# EAGLE design SFT_BatteryManager1.0v (EAGLE 7.5.0)
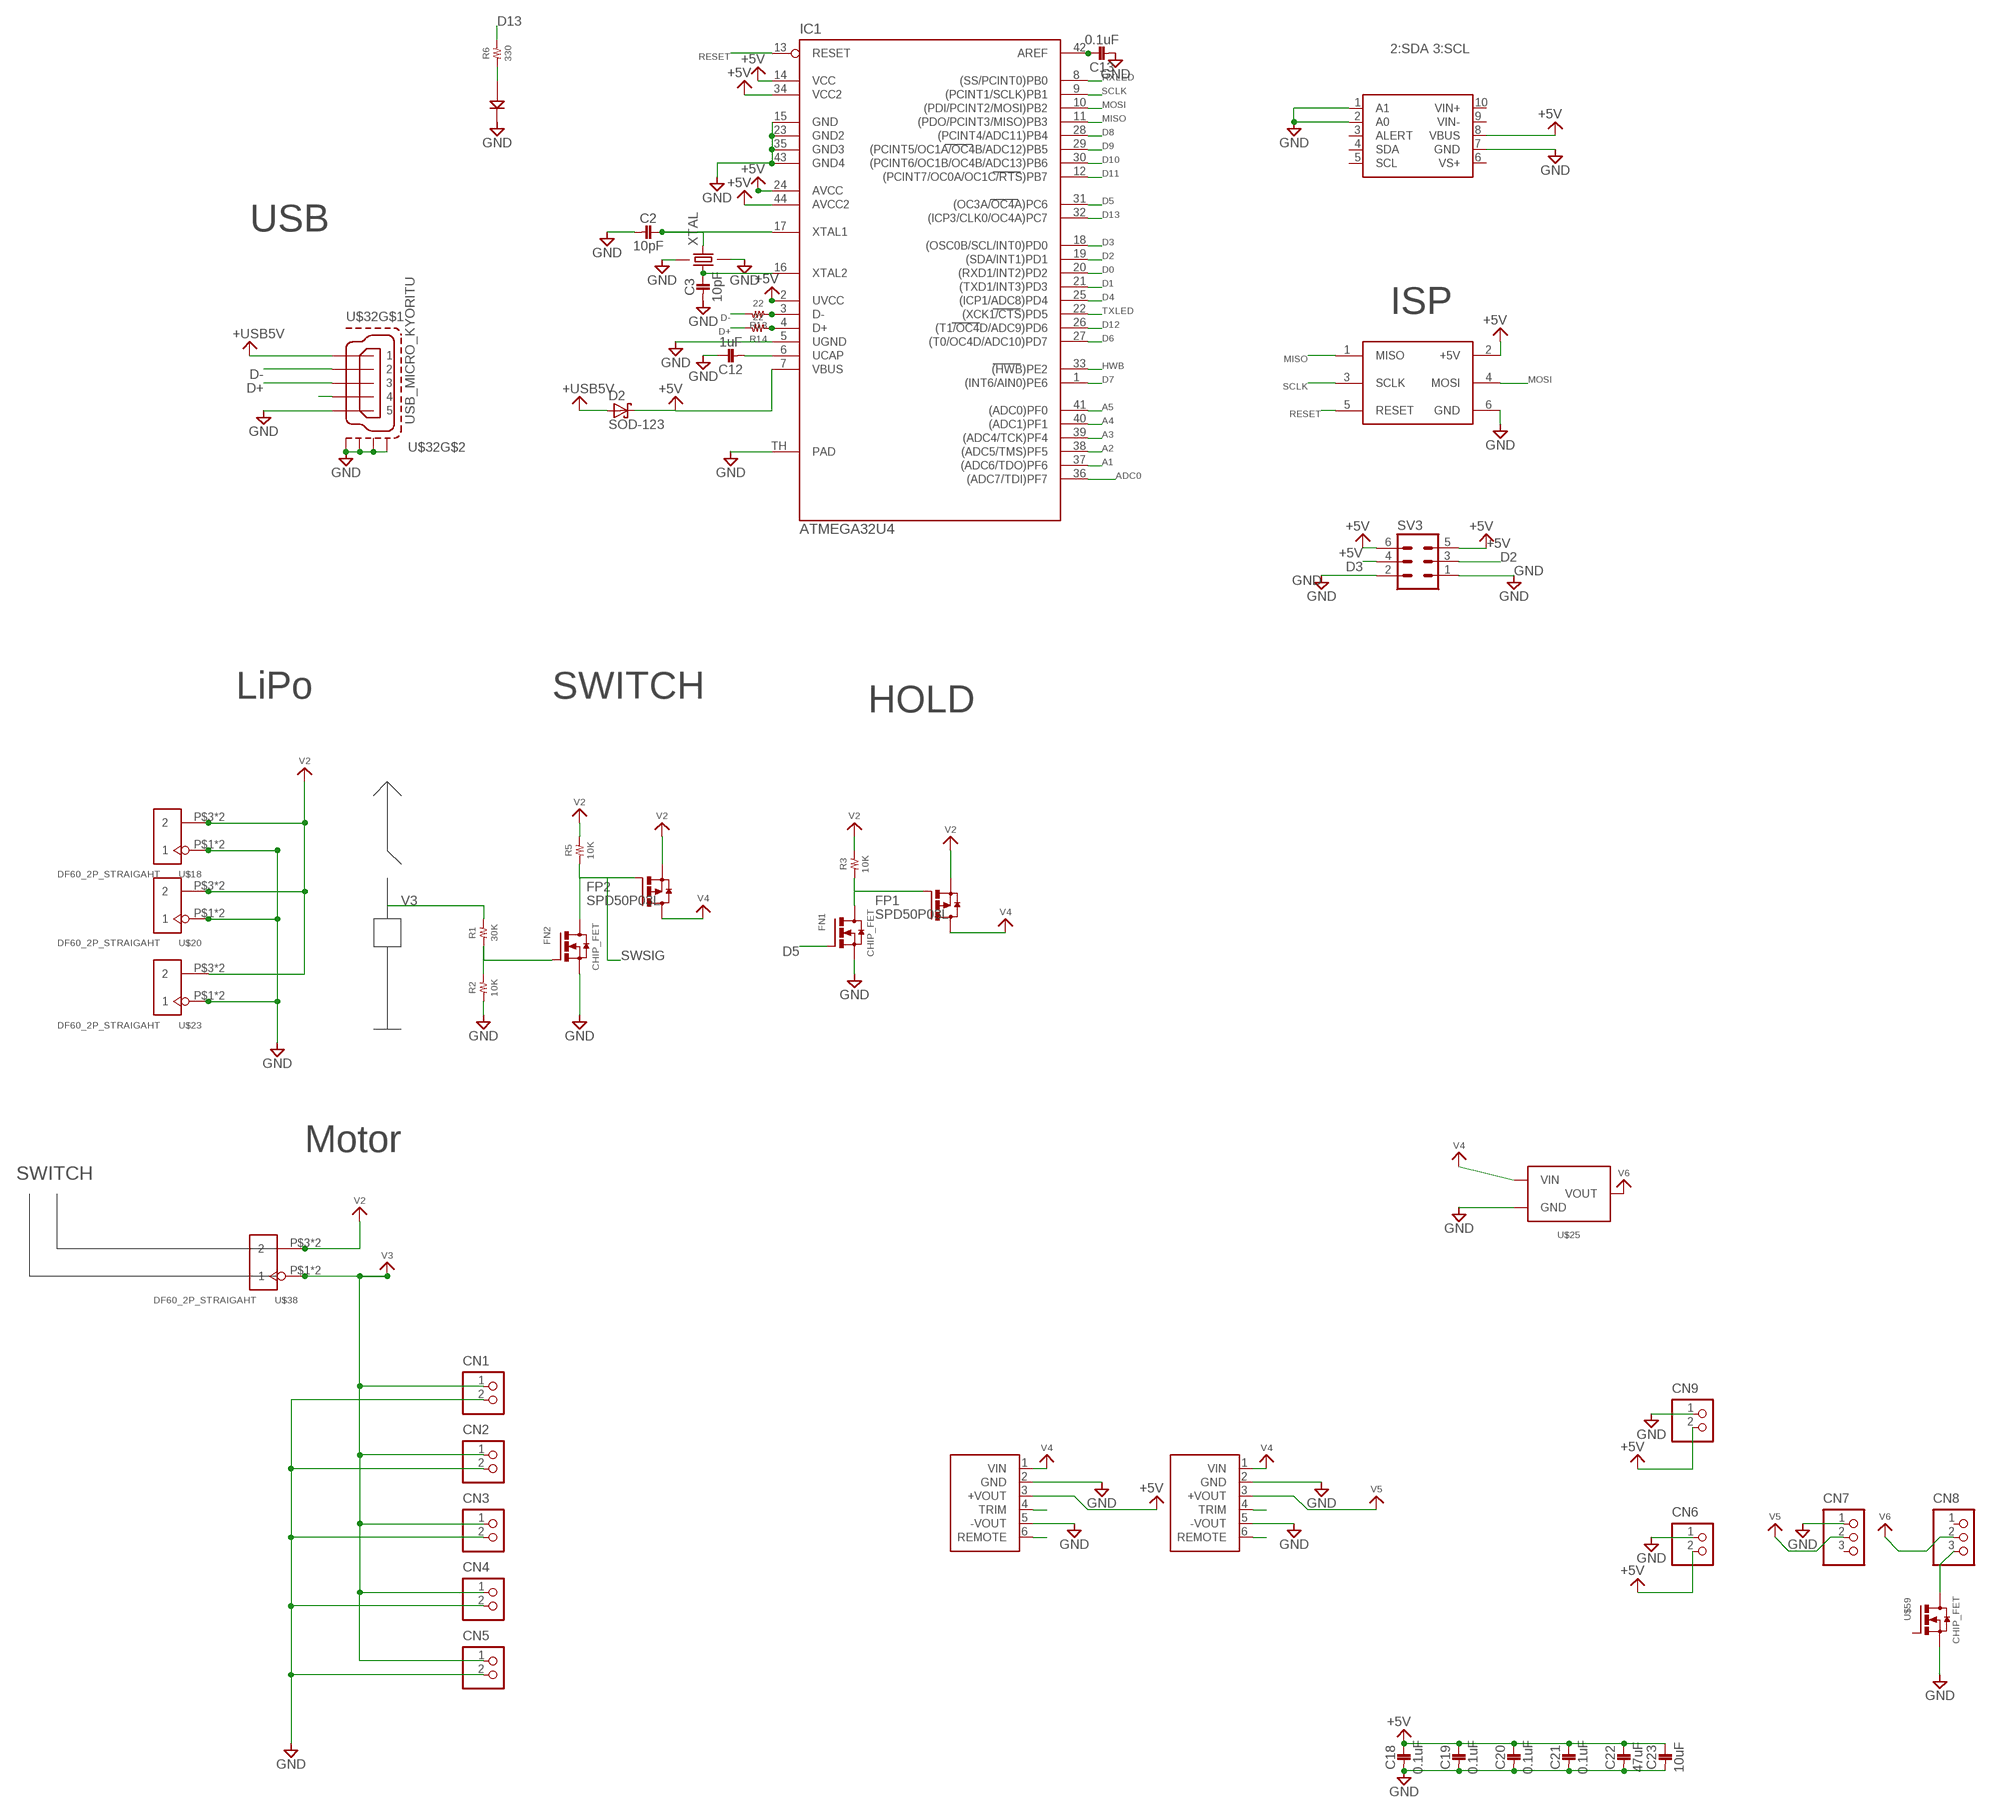
[diagram p0: schematic, sheet 1]

## Parts
C2  10pF  1005  [1005]
C3  10pF  1005  [1005]
C12  1uF  1005  [1005]
C13  0.1uF  1005  [1005]
C18  0.1uF  1005  [1005]
C19  0.1uF  1005  [1005]
C20  0.1uF  1005  [1005]
C21  0.1uF  1005  [1005]
C22  47uF  1608  [1608]
C23  10uF  1608  [1608]
CN1  B2P-VH  [B2P-VH]
CN2  B2P-VH  [B2P-VH]
CN3  B2P-VH  [B2P-VH]
CN4  B2P-VH  [B2P-VH]
CN5  B2P-VH  [B2P-VH]
CN6  B2B-XASK-1  [B2B-XASK-1]
CN7  B3P-VH  [B3P-VH]
CN8  B3P-VH  [B3P-VH]
CN9  B2B-XASK-1  [B2B-XASK-1]
D2  SOD-123  [SOD_123]
FN1  CHIP_FET  [SOT23]
FN2  CHIP_FET  [SOT23]
FP1  SPD50P03L  [TO252-5-11]
FP2  SPD50P03L  [TO252-5-11]
IC1  ATMEGA32U4  [QFN-44-7X7]
LED1  3MMLED  [3MM]
R1  30K  RESISTOR_1005  [1005]
R2  10K  RESISTOR_1005  [1005]
R3  10K  RESISTOR_1005  [1005]
R5  10K  RESISTOR_1005  [1005]
R6  330  RESISTOR_1005  [1005]
R13  22  RESISTOR_1005  [1005]
R14  22  RESISTOR_1005  [1005]
SV3  ML6  [ML6]
U$3  ICSP  [ICSP]
U$4  INA226  [MSOP10]
U$18  DF60_2P_STRAIGAHT  [DF60_2P_STRAIGHT]
U$20  DF60_2P_STRAIGAHT  [DF60_2P_STRAIGHT]
U$23  DF60_2P_STRAIGAHT  [DF60_2P_STRAIGHT]
U$25  Ｒ－７８Ｅ５．０  [Ｒ－７８Ｅ５．０]
U$29  TRACO_THL  [TRACO_THL]
U$32  USB_MICRO_KYORITU  [USB_MICRO_KYORITU]
U$38  DF60_2P_STRAIGAHT  [DF60_2P_STRAIGHT]
U$59  CHIP_FET  [SOT23]
U$62  TRACO_THL  [TRACO_THL]
XTAL  FA-238  [FA-238]

## Nets
+5V: C18.1 C19.1 C20.1 C21.1 C22.P$1 C23.P$1 CN6.2 CN9.2 D2.C IC1.2(UVCC) IC1.7(VBUS) IC1.14(VCC) IC1.24(AVCC) IC1.34(VCC2) IC1.44(AVCC2) SV3.5 SV3.6 U$3.2(+5V) U$4.8(VBUS) U$29.3(+VOUT)
+USB5V: D2.A U$32.1
A1: IC1.37((ADC6/TDO)PF6)
A2: IC1.38((ADC5/TMS)PF5)
A3: IC1.39((ADC4/TCK)PF4)
A4: IC1.40((ADC1)PF1)
A5: IC1.41((ADC0)PF0)
ADC0: IC1.36((ADC7/TDI)PF7)
D0: IC1.20((RXD1/INT2)PD2)
D1: IC1.21((TXD1/INT3)PD3)
D2: IC1.19((SDA/INT1)PD1) SV3.3
D3: IC1.18((OSC0B/SCL/INT0)PD0) SV3.4
D4: IC1.25((ICP1/ADC8)PD4)
D5: FN1.1(G) IC1.31((OC3A/OC4A)PC6)
D6: IC1.27((T0/OC4D/ADC10)PD7)
D7: IC1.1((INT6/AIN0)PE6)
D8: IC1.28((PCINT4/ADC11)PB4)
D9: IC1.29((PCINT5/OC1A/OC4B/ADC12)PB5)
D10: IC1.30((PCINT6/OC1B/OC4B/ADC13)PB6)
D11: IC1.12((PCINT7/OC0A/OC1C/RTS)PB7)
D12: IC1.26((T1/OC4D/ADC9)PD6)
D13: IC1.32((ICP3/CLK0/OC4A)PC7) R6.2
D+: R14.2 U$32.3
D-: R13.2 U$32.2
GND: C2.2 C3.2 C12.1 C13.2 C18.2 C19.2 C20.2 C21.2 C22.P$2 C23.P$2 CN1.2 CN2.2 CN3.2 CN4.2 CN5.2 CN6.1 CN7.1 CN9.1 FN1.2(S) FN2.2(S) IC1.5(UGND) IC1.15(GND) IC1.23(GND2) IC1.35(GND3) IC1.43(GND4) IC1.TH(PAD) LED1.K R2.1 SV3.1 SV3.2 U$3.6(GND) U$4.1(A1) U$4.2(A0) U$4.7(GND) U$18.P$1 U$18.P$2 U$20.P$1 U$20.P$2 U$23.P$1 U$23.P$2 U$25.2(GND) U$29.2(GND) U$29.5(-VOUT) U$32.5 U$32.M1(S1) U$32.M2(S2) U$32.M3(S3) U$32.M4(S4) U$59.2(S) U$62.2(GND) U$62.5(-VOUT) XTAL.2 XTAL.4
HWB: IC1.33((HWB)PE2)
MISO: IC1.11((PDO/PCINT3/MISO)PB3) U$3.1(MISO)
MOSI: IC1.10((PDI/PCINT2/MOSI)PB2) U$3.4(MOSI)
N$1: LED1.A R6.1
N$2: FN2.1(G) R1.1 R2.2
N$3: U$29.4(TRIM)
N$4: U$32.4
N$5: U$29.6(REMOTE)
N$6: FN1.3(D) FP1.1(G) FP1.2(G) R3.1
N$7: C3.1 IC1.16(XTAL2) XTAL.1
N$8: IC1.3(D-) R13.1
N$9: C13.1 IC1.42(AREF)
N$10: C2.1 IC1.17(XTAL1) XTAL.3
N$11: U$62.4(TRIM)
N$12: U$62.6(REMOTE)
N$13: CN8.3 U$59.3(D)
N$14: IC1.4(D+) R14.1
N$18: C12.2 IC1.6(UCAP)
RESET: IC1.13(RESET) U$3.5(RESET)
RXLED: IC1.8((SS/PCINT0)PB0)
SCLK: IC1.9((PCINT1/SCLK)PB1) U$3.3(SCLK)
SWSIG: FN2.3(D) FP2.1(G) FP2.2(G) R5.1
TXLED: IC1.22((XCK1/CTS)PD5)
V2: FP1.4(S) FP1.5(S) FP2.4(S) FP2.5(S) R3.2 R5.2 U$18.P$3 U$18.P$4 U$20.P$3 U$20.P$4 U$23.P$3 U$23.P$4 U$38.P$3 U$38.P$4
V3: CN1.1 CN2.1 CN3.1 CN4.1 CN5.1 R1.2 U$38.P$1 U$38.P$2
V4: FP1.TAB(D) FP2.TAB(D) U$25.1(VIN) U$29.1(VIN) U$62.1(VIN)
V5: CN7.2 U$62.3(+VOUT)
V6: CN8.2 U$25.3(VOUT)
Unconnected: CN7.3 CN8.1 U$4.3(ALERT) U$4.4(SDA) U$4.5(SCL) U$4.6(VS+) U$4.9(VIN-) U$4.10(VIN+) U$59.1(G)

## Notes on the sheet
- 2:SDA 3:SCL
- USB
- ISP
- LiPo | SWITCH
- HOLD
- Motor
- SWITCH

## Library data of the parts
C2 C3 C12 C13 C18-C21 = 02_C:1005
C22 C23 = 02_C:1608
CN1-CN5 = jst-vh:B2P-VH: Wire-to-Board 3.96mm pitch top mount connector Source: http://www.jst-mfg.com/product/pdf/jpn/VH.pdf http://www.jst-mfg.com/product/detail.php?series=262
CN6 CN9 = jst-xa:B2B-XASK-1: Wire-to-Board 2.5mm pitch top mount connector Source: http://www.jst-mfg.com/product/pdf/jpn/XA1.pdf http://www.jst-mfg.com/product/detail.php?series=272
CN7 CN8 = jst-vh:B3P-VH: Wire-to-Board 3.96mm pitch top mount connector Source: http://www.jst-mfg.com/product/pdf/jpn/VH.pdf http://www.jst-mfg.com/product/detail.php?series=262
D2 = 15_DIODE:SOD-123
FN1 FN2 U$59 = 06_FET:CHIP_FET
FP1 FP2 = 06_FET:SPD50P03L
IC1 = 04_IC:ATMEGA32U4
LED1 = 10_LED:3MMLED
R1-R3 R5 R6 R13 R14 = 01_R:RESISTOR_1005
SV3 = con-ml:ML6: HARTING; OC_FARNELL: unknown; OC_NEWARK: unknown
U$3 = 08_CONECTOR:ICSP
U$4 = 04_IC:INA226
U$18 U$20 U$23 U$38 = 08_CONECTOR:DF60_2P_STRAIGAHT
U$25 = 04_IC:Ｒ－７８Ｅ５．０
U$29 U$62 = 04_IC:TRACO_THL
U$32 = 08_CONECTOR:USB_MICRO_KYORITU
XTAL = 09_2_CRYSTAL:FA-238

## Net classes
1 POWER: width 0.5 mm, clearance 0.5 mm

## Board
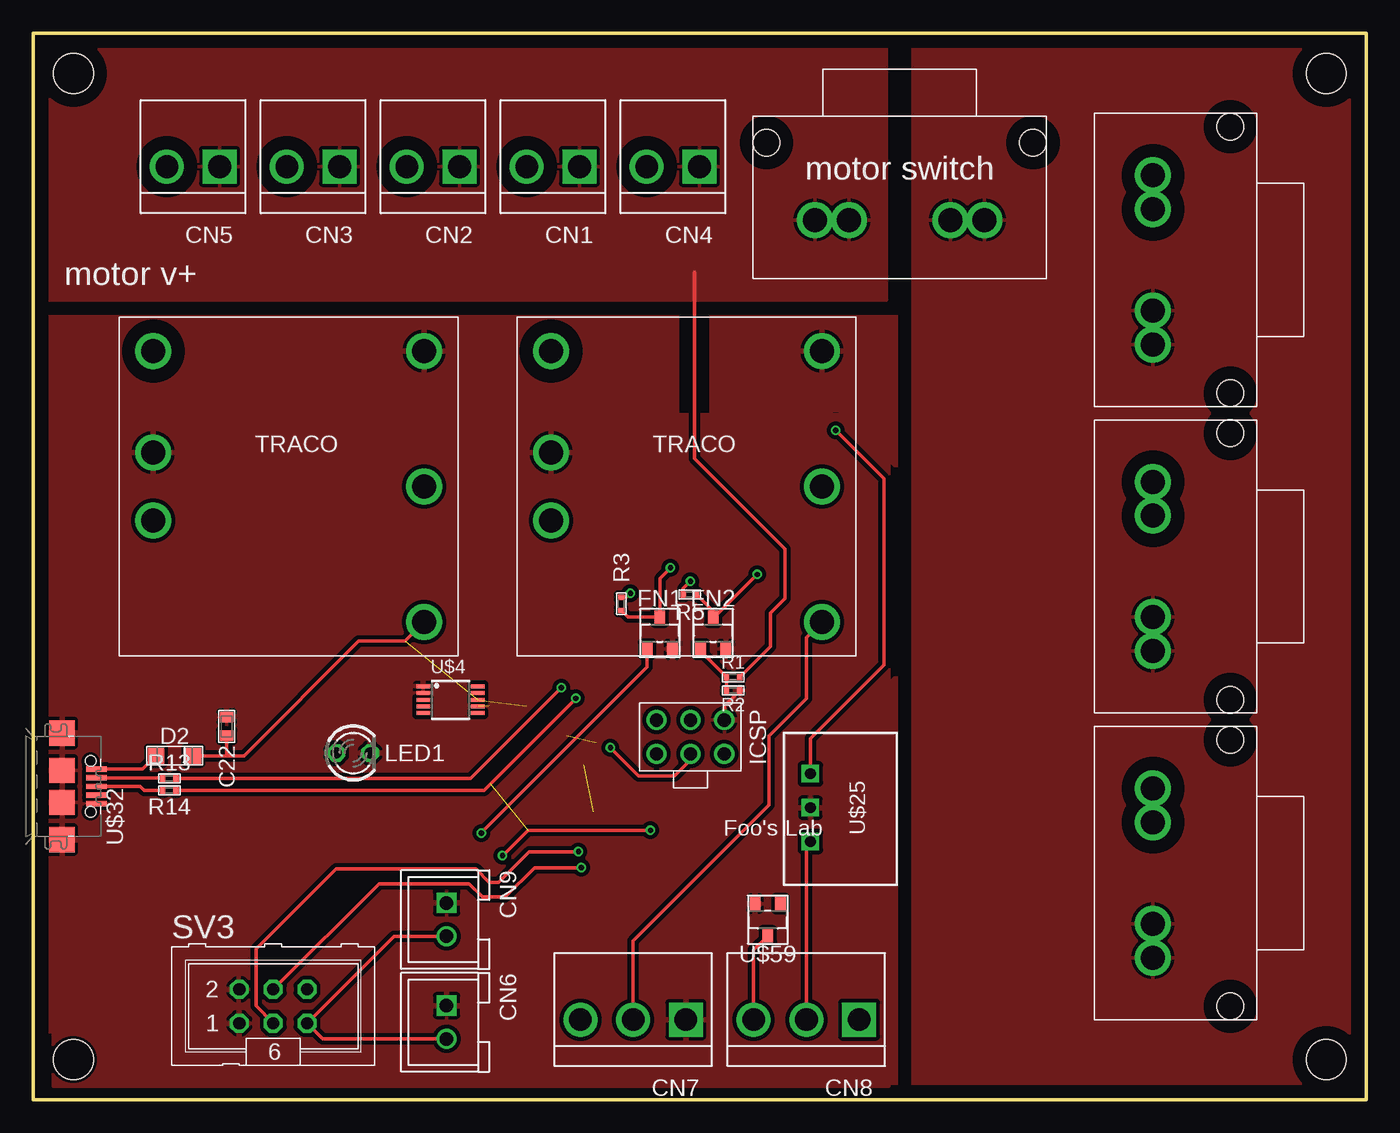
[diagram p1: board, top side]
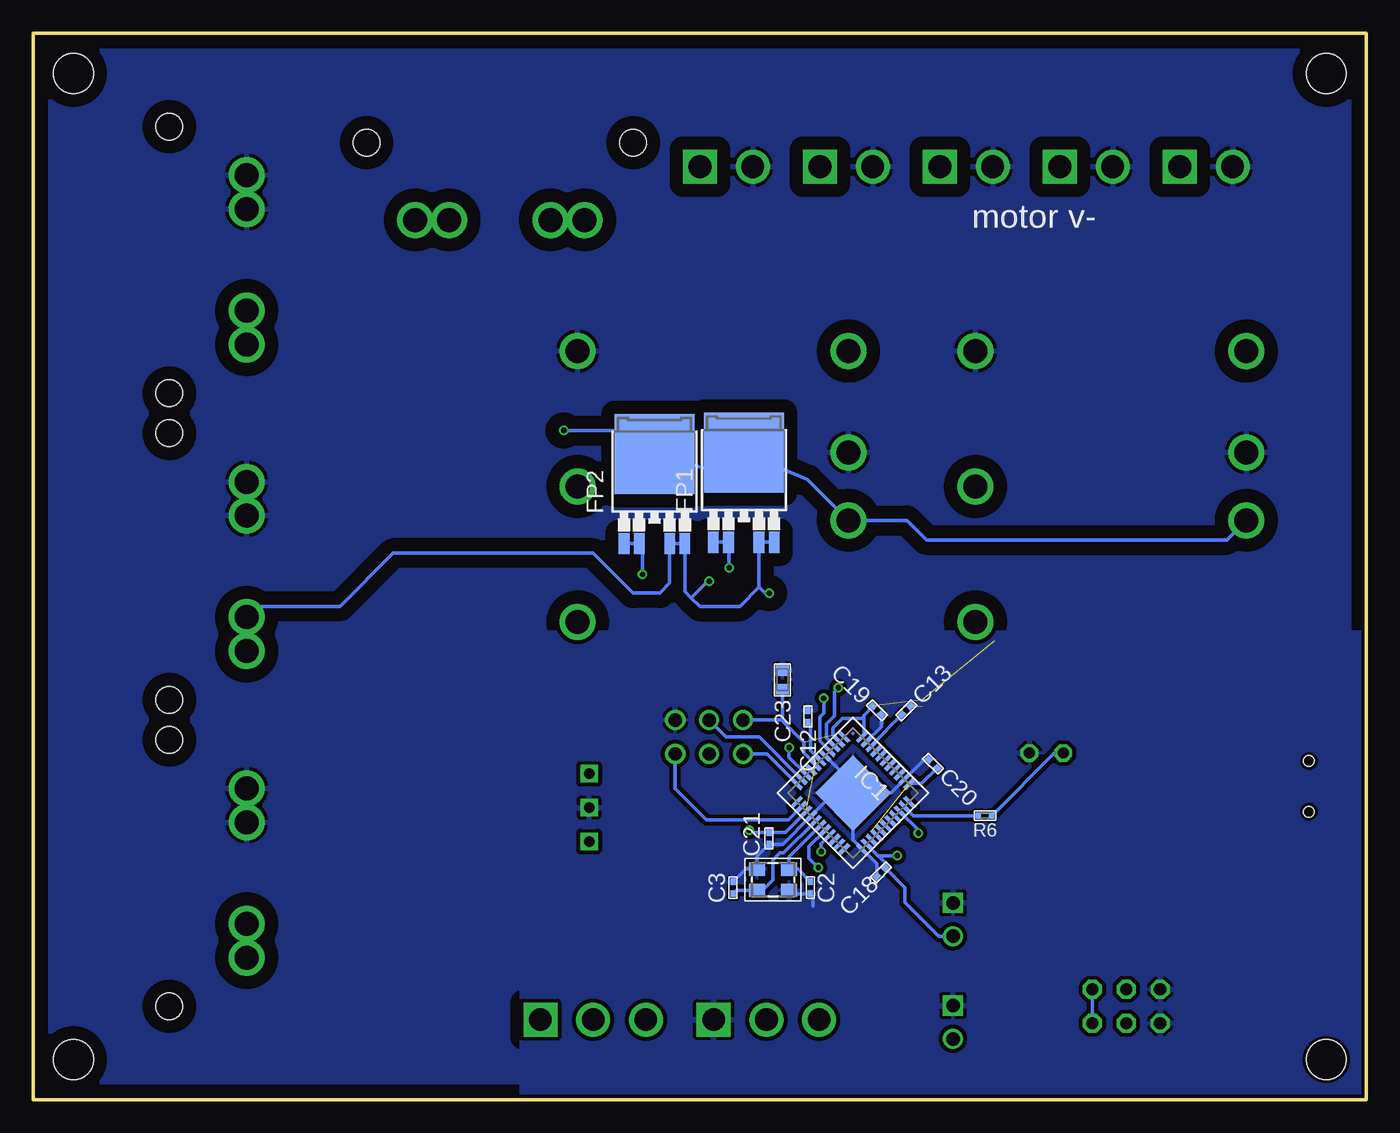
[diagram p2: board, bottom side, seen from below]

Size 100 x 80 mm. Coordinates in mm from the lower left corner, seen from the top.
Outline: 0,0 100,0 100,80 0,80 0,0
Copper layers (1*16): Top 0.035mm / dielectric 1.5mm / Bottom 0.035mm
Design rules "LPKF": minimum track width 6mil, minimum drill 12mil, track to track 0.3mm, track to pad 0.3mm, pad to pad 0.3mm, via to via 0.3mm, smd to smd 0mil, copper to edge 10mil, drill to drill 0.4mm, minimum pad ring 10mil, minimum via ring 6mil, stop-mask expansion 2mil, vias tented up to drill 100mil, thermal gap 10mil
Holes 3 mm at 97,77 97,3 3,3 3,77

### Footprints (pad centres in the part's own frame; a part is rotated, then mirrored left to right if it is on the bottom)
1005 = smd 0.5 x 0.4: 1 -0.45,0; 2 0.45,0
1608 = smd 0.8 x 1: P$1 -0.7,0; P$2 0.7,0
B2P-VH = drill 1.7 square: 1 -1.98,0 | drill 1.7: 2 1.98,0
B2B-XASK-1 = drill 1.016 square: 1 -1.25,0 | drill 1.016: 2 1.25,0
B3P-VH = drill 1.7 square: 1 -3.96,0 | drill 1.7: 2 0,0; 3 3.96,0
SOD_123 = smd 1.2 x 1.2: A -1.4,0; C 1.4,0
SOT23 = smd 0.8 x 1: 1 -0.95,-1.2; 2 0.95,-1.2; 3 0,1.2
TO252-5-11 = smd 0.8 x 1.6: 1 -2.28,-4.775; 2 -1.14,-4.775; 4 1.14,-4.775; 5 2.28,-4.775 | smd 6 x 6: TAB 0,1.935
QFN-44-7X7 = smd 1.1 x 0.3: 1 -3.5,2.5; 2 -3.5,2; 3 -3.5,1.5; 4 -3.5,1; 5 -3.5,0.5; 6 -3.5,0; 7 -3.5,-0.5; 8 -3.5,-1; 9 -3.5,-1.5; 10 -3.5,-2; 11 -3.5,-2.5; 23 3.5,-2.5; 24 3.5,-2; 25 3.5,-1.5; 26 3.5,-1; 27 3.5,-0.5; 28 3.5,0; 29 3.5,0.5; 30 3.5,1; 31 3.5,1.5; 32 3.5,2; 33 3.5,2.5 | smd 0.3 x 1.1: 12 -2.5,-3.5; 13 -2,-3.5; 14 -1.5,-3.5; 15 -1,-3.5; 16 -0.5,-3.5; 17 0,-3.5; 18 0.5,-3.5; 19 1,-3.5; 20 1.5,-3.5; 21 2,-3.5; 22 2.5,-3.5; 34 2.5,3.5; 35 2,3.5; 36 1.5,3.5; 37 1,3.5; 38 0.5,3.5; 39 0,3.5; 40 -0.5,3.5; 41 -1,3.5; 42 -1.5,3.5; 43 -2,3.5; 44 -2.5,3.5 | smd 4 x 4: TH 0,0
3MM = drill 0.813 octagon: A 0,1.27; K 0,-1.27
1005' = smd 0.4 x 0.5: 1 -0.5,0; 2 0.5,0
ML6 = drill 0.914 octagon: 1 -2.54,-1.27; 2 -2.54,1.27; 3 0,-1.27; 4 0,1.27; 5 2.54,-1.27; 6 2.54,1.27
ICSP = drill 1 pad 1.5: 1 -1.27,2.54; 2 1.27,2.54; 3 -1.27,0; 4 1.27,0; 5 -1.27,-2.54; 6 1.27,-2.54
MSOP10 = smd 0.3 x 1: 1 -1,-2.05; 2 -0.5,-2.05; 3 0,-2.05; 4 0.5,-2.05; 5 1,-2.05; 6 1,2.05; 7 0.5,2.05; 8 0,2.05; 9 -0.5,2.05; 10 -1,2.05
DF60_2P_STRAIGHT = drill 1.8: P$1 -6.35,0; P$2 -3.81,0; P$3 3.81,0; P$4 6.35,0 | hole 2: -10,5.8; 10,5.8
Ｒ－７８Ｅ５．０ = drill 0.8 square: 1 -2.54,0; 2 0,0; 3 2.54,0
TRACO_THL = drill 1.8: 1 -10.16,-2.54; 2 -10.16,2.54; 3 10.16,-10.16; 4 10.16,0; 5 10.16,10.16; 6 -10.16,10.16
USB_MICRO_KYORITU = smd 0.4 x 1.55: 1 -1.3,-0.775; 2 -0.65,-0.775; 3 0,-0.775; 4 0.65,-0.775; 5 1.3,-0.775 | smd 1.9 x 1.9: M1 4,-3.35; M2 -4,-3.35; M3 -1.2,-3.35; M4 1.2,-3.35 | hole 0.8: -1.9,-1.2; 1.9,-1.2
FA-238 = smd 1.2 x 1: 1 -1.2,-0.8; 2 1.2,-0.8; 3 1.2,0.8; 4 -1.2,0.8

### Placement (x,y rotation side)
C2  41.7,15.9 270 bottom
C3  47.5,15.9 90 bottom
C12  41.9,28.75 270 bottom
C13  34.5,29.2 45 bottom
C18  36.4,17.05 225 bottom
C19  36.7,29.2 315 bottom
C20  32.5,25.2 135 bottom
C21  44.8,19.6 270 bottom
C22  14.5,28 90 top
C23  43.8,31.5 90 bottom
CN1  39,70 180 top
CN2  30,70 180 top
CN3  21,70 180 top
CN4  48,70 180 top
CN5  12,70 180 top
CN6  31,5.8 270 top
CN7  45,6 180 top
CN8  58,6 180 top
CN9  31,13.5 270 top
D2  10.6,25.8 0 top
FN1  47,35 0 top
FN2  51,35 0 top
FP1  46.7,46.6 0 bottom
FP2  53.4,46.5 0 bottom
IC1  38.5,23 315 bottom
LED1  24,26 90 top
R1  30K  [1005']  52.5,31.7 0 top
R2  10K  [1005']  52.5,30.7 180 top
R3  10K  [1005']  44.1,37.2 90 top
R5  10K  [1005']  49.25,37.9 180 top
R6  330  [1005']  28.6,21.3 180 bottom
R13  22  [1005']  10.2,24.1 180 top
R14  22  [1005']  10.2,23.2 180 top
SV3  18,7 0 top
U$3  49.3,27.2 90 top
U$4  31.3,30 270 top
U$18  84,63 270 top
U$20  84,40 270 top
U$23  84,17 270 top
U$25  58.3,21.9 270 top
U$29  19.16,46 0 top
U$32  5.5,23.5 270 top
U$38  65,66 0 top
U$59  55.1,13.5 180 top
U$62  49,46 0 top
XTAL  44.5,16.5 0 bottom

### Tracks (layer width: path | path; a pad name or v marks a point on that pad's centre or on a via)
+5V  (via drill 0.4)  (5 unrouted)
  Top 0.25: D2.C 14.4,25.8 | 14.4,25.8 15.8,25.8 24.4,34.4 27.88,34.4 U$29.3 | C22.P$1 14.5,25.9 14.4,25.8 | v35.2,18.3 37.1,20.2 v46.3,20.2 | CN6.2 21.72,4.55 SV3.5 27.06,12.25 CN9.2
  Bottom 0.25: IC1.14 43.57,20.05 C21.1 46.15,20.05 v46.3,20.2 | 43.87,28.47 U$3.2 | IC1.7 42.2,25.99 42.2,26.8 43.87,28.47 | IC1.34 33.36,23.71 C20.1 | IC1.44 37.7,27.34 37.7,28.6 | 37.7,28.6 37.7,28.84 C19.1 | C23.P$1 43.8,28.54 43.87,28.47 | IC1.2 40,27.33 40,27.9 39.3,28.6 37.7,28.6 | SV3.6 SV3.5 | v35.2,18.3 36.63,18.3 IC1.24 36.08,17.75 C18.1 34.6,15.89 34.6,14.8 32.05,12.25 CN9.2
+USB5V
  Top 0.25: U$32.1 8.2,24.8 D2.A
D2  (via drill 0.4)
  Top 0.25: SV3.3 16.7,7.03 16.7,11.3 22.7,17.3 33.2,17.3 34.2,16.3 34.9,16.3 37.2,18.6 v40.9,18.6
  Bottom 0.25: v40.9,18.6 40.9,19.19 IC1.19
D3  (via drill 0.4)
  Top 0.25: v41.1,17.4 37.6,17.4 35.4,15.2 33.7,15.2 32.7,16.2 25.93,16.2 SV3.4
  Bottom 0.25: v41.1,17.4 41.8,18.1 41.8,18.99 IC1.18
D5  (via drill 0.4)
  Top 0.25: v33.6,20 46.05,32.45 FN1.1
  Bottom 0.25: IC1.31 33.6,20.22 v33.6,20
D13
  Bottom 0.25: IC1.32 33.97,21.3 R6.2
D+
  Top 0.25: U$32.3 8,23.5 8.3,23.2 R14.2
D-
  Top 0.25: U$32.2 9.65,24.15 R13.2
GND  (1 unrouted)
  Top 0.25: R2.1 51.84,29.54 U$3.6
  Bottom 0.25: C3.2 46.55,17.3 XTAL.4 45.7,18.25 C21.2 43.76,19.15 IC1.15 39.91,23 IC1.TH | XTAL.2 43.05,15.45 C2.2 41.5,15.25 41.5,14.5 | IC1.5 38.5,23.71 IC1.TH | IC1.TH 38.5,19.46 IC1.23 36.72,17.68 C18.2 | IC1.TH 35.67,23 IC1.35 33.15,25.52 C20.2 | IC1.43 36.38,27.95 C19.2
  pour Bottom (isolate 1, rank 6): -10,90 110,90 110,-5 -10,-5
  pour Top (isolate 1, rank 6): -10,85 115,85 115,-5 -10,-5
  pour Top: 1.5,51.4 64.2,51.4 64.2,1 1.5,1
  pour Bottom: 0.4,0.3 63.4,0.3 63.4,35.1 0.4,35.1
MISO
  Bottom 0.25: IC1.11 44.97,25.93 U$3.1
MOSI
  Bottom 0.25: IC1.10 45.53,27.2 48.03,27.2 U$3.4
N$1
  Bottom 0.25: R6.1 23.4,26 LED1.A
N$2
  Top 0.25: FN2.1 50.05,33.65 R1.1 R2.2
N$6  (via drill 0.4)
  Top 0.25: v47.8,39.9 47,39.1 FN1.3 44.6,36.2 R3.1
  Bottom 0.25: FP1.1 FP1.2 47.8,41.78 v47.8,39.9
N$7
  Bottom 0.25: IC1.16 43.71,18.5 44,18.5 44.5,18 44.5,16.5 45.3,15.7 XTAL.1 47.25,15.7 C3.1
N$8  (via drill 0.4)
  Top 0.25: v39.6,30.9 32.8,24.1 R13.1
  Bottom 0.25: IC1.3 40.5,27.12 40.5,28.2 39.9,28.8 39.9,30.6 v39.6,30.9
N$9
  Bottom 0.25: IC1.42 37.09,26.61 C13.1
N$10
  Bottom 0.25: IC1.17 43.3,18.2 XTAL.3 42.65,17.3 C2.1
N$13
  Top 0.25: CN8.3 54.04,11.24 U$59.3
N$14  (via drill 0.4)
  Top 0.25: v40.7,30.1 33.8,23.2 R14.1
  Bottom 0.25: IC1.4 41,26.91 41,28.7 40.7,29 v40.7,30.1
N$18
  Bottom 0.25: IC1.6 41.7,26.2 41.7,28.1 C12.2
RESET
  Bottom 0.25: IC1.13 43.33,21 49.5,21 51.84,23.34 U$3.5
SCLK  (via drill 0.4)
  Top 0.25: v43.3,26.4 45.4,24.3 48.1,24.3 49.3,25.5 U$3.3
  Bottom 0.25: IC1.9 43.3,25.68 v43.3,26.4
SWSIG  (via drill 0.4)
  Top 0.25: v54.3,39.4 51.1,36.2 FN2.3 51,36.65 R5.1
  Bottom 0.25: FP2.1 FP2.2 54.3,41.48 v54.3,39.4
V2  (via drill 0.4)
  Top 0.25: R3.2 44.5,37.7 v44.8,38 | R5.2 48.75,38.35 v49.3,38.9
  Bottom 0.25: 50.65,37.65 51.12,38.12 FP2.5 FP2.4 52.26,38.74 53,38 55,38 58,41 73,41 77,37 83.19,37 U$20.P$3 | 50.65,37.65 50,37 47,37 45.56,38.44 | 45.56,38.44 FP1.4 FP1.5 | v44.8,38 45.12,38 45.56,38.44 | v49.3,38.9 49.4,38.9 50.65,37.65
  pour Top (isolate 1, rank 3): 66,85 105,85 105,-10 66,-10
V3
  Top 0.25: R1.2 55.3,34 55.3,36.5 56.4,37.6 56.4,41.3 49.6,48.1 49.6,62.1
  pour Top (isolate 1): 64,60 -5,60 -5,85 64,85
V4  (via drill 0.4)
  Top 0.25: U$25.1 58.3,27.1 63.8,32.6 63.8,46.6 v60.2,50.2
  Bottom 0.25: U$29.1 10.46,42 33,42 34.46,43.46 U$62.1 41.91,46.53 FP1.TAB 46.16,46 46,46 46.44,46.44 FP2.TAB 55.16,50.2 v60.2,50.2
V5
  Top 0.25: U$62.3 58,34.68 58,30.1 55.2,27.3 55.2,22.1 45,11.9 CN7.2
V6
  Top 0.25: CN8.2 58,19.06 U$25.3

### Text on the board
tPlace: motor switch | motor v+ | Foo's Lab
bPlace: motor v-
_bPlace: L1
_tNames: C12 | R1 | FN4 | R2 | R13 | IC2 | R14 | C7 | C8 | LED1 | SW2 | R8 | C14 | C16 | C15 | R5 | IC4 | FNP1 | D2 | R17 | R16
_bNames: D1 | C6 | CN1 | C19 | C5 | R18 | C13 | IC3 | R15 | R11 | C23 | FPP | C1 | R3 | IC1 | R6 | C20 | FN1 | C22 | C21 | BLE | R9 | C2 | C3 | C18 | R4